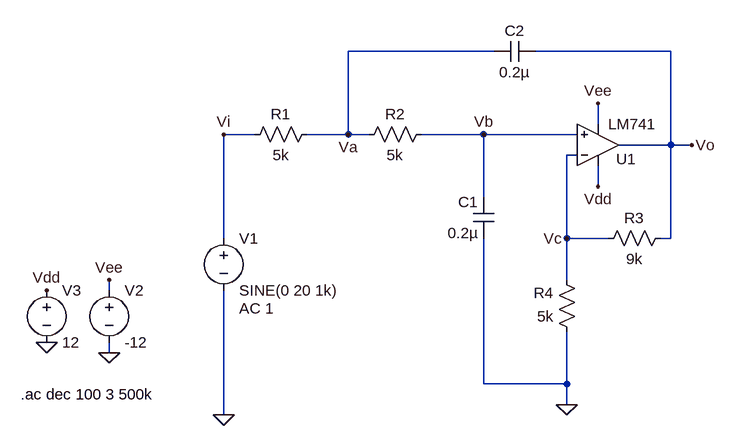
[diagram p0: schematic Sallen-Key-LM741.asc]
Sallen-Key-LM741.asc, the LTspice schematic file:
Version 4
SHEET 1 952 680
WIRE 368 48 144 48
WIRE 640 48 432 48
WIRE 528 160 528 128
WIRE 0 176 -48 176
WIRE 144 176 144 48
WIRE 144 176 80 176
WIRE 176 176 144 176
WIRE 352 176 256 176
WIRE 496 176 352 176
WIRE 640 192 640 48
WIRE 640 192 560 192
WIRE 672 192 640 192
WIRE 496 208 480 208
WIRE 528 256 528 224
WIRE 352 272 352 176
WIRE -48 336 -48 176
WIRE 480 336 480 208
WIRE 544 336 480 336
WIRE 640 336 640 192
WIRE 640 336 624 336
WIRE 480 400 480 336
WIRE -224 416 -224 400
WIRE -224 512 -224 496
WIRE 352 560 352 336
WIRE 480 560 480 480
WIRE 480 560 352 560
WIRE 480 592 480 560
WIRE -48 608 -48 416
FLAG 480 592 0
FLAG -48 608 0
FLAG -224 512 0
FLAG -320 496 0
FLAG -320 416 Vdd
FLAG 528 256 Vdd
FLAG -224 400 Vee
FLAG 528 128 Vee
FLAG 672 192 Vo
FLAG 144 176 Va
FLAG 352 176 Vb
FLAG 480 336 Vc
FLAG -48 176 Vi
SYMBOL res 96 160 R90
WINDOW 0 0 56 VBottom 2
WINDOW 3 32 56 VTop 2
SYMATTR InstName R1
SYMATTR Value 5k
SYMBOL res 272 160 R90
WINDOW 0 0 56 VBottom 2
WINDOW 3 32 56 VTop 2
SYMATTR InstName R2
SYMATTR Value 5k
SYMBOL cap 432 32 R90
WINDOW 0 0 32 VBottom 2
WINDOW 3 32 32 VTop 2
SYMATTR InstName C2
SYMATTR Value 0.2µ
SYMBOL cap 368 336 R180
WINDOW 0 24 56 Left 2
WINDOW 3 24 8 Left 2
SYMATTR InstName C1
SYMATTR Value 0.2µ
SYMBOL res 640 320 R90
WINDOW 0 0 56 VBottom 2
WINDOW 3 32 56 VTop 2
SYMATTR InstName R3
SYMATTR Value 9k
SYMBOL res 496 496 R180
WINDOW 0 36 76 Left 2
WINDOW 3 36 40 Left 2
SYMATTR InstName R4
SYMATTR Value 5k
SYMBOL AutoGenerated\\LM741 528 192 M180
WINDOW 0 28 -22 Left 2
SYMATTR InstName U1
SYMBOL voltage -48 320 R0
WINDOW 123 24 124 Left 2
WINDOW 39 0 0 Left 0
SYMATTR Value2 AC 1
SYMATTR InstName V1
SYMATTR Value SINE(0 20 1k)
SYMBOL voltage -224 400 R0
WINDOW 123 0 0 Left 0
WINDOW 39 0 0 Left 0
SYMATTR InstName V2
SYMATTR Value -12
SYMBOL voltage -320 400 R0
WINDOW 123 0 0 Left 0
WINDOW 39 0 0 Left 0
SYMATTR InstName V3
SYMATTR Value 12
TEXT -360 576 Left 2 !.ac dec 100 3 500k

The netlist it stands for:
* Sallen-Key-LM741.asc
R1 Va Vi 5k
R2 Vb Va 5k
C2 Vo Va 0.2µ
C1 0 Vb 0.2µ
R3 Vo Vc 9k
R4 0 Vc 5k
* U1: LM741 (symbol AutoGenerated\LM741 not available, pins judged from their places): In+=Vb In-=Vc V+=Vdd V-=Vee OUT=Vo
V1 Vi 0 SINE(0 20 1k) AC 1
V2 Vee 0 -12
V3 Vdd 0 12
.ac dec 100 3 500k
.backanno
.end